# EAGLE design pickit3_adapter (EAGLE 6.2)
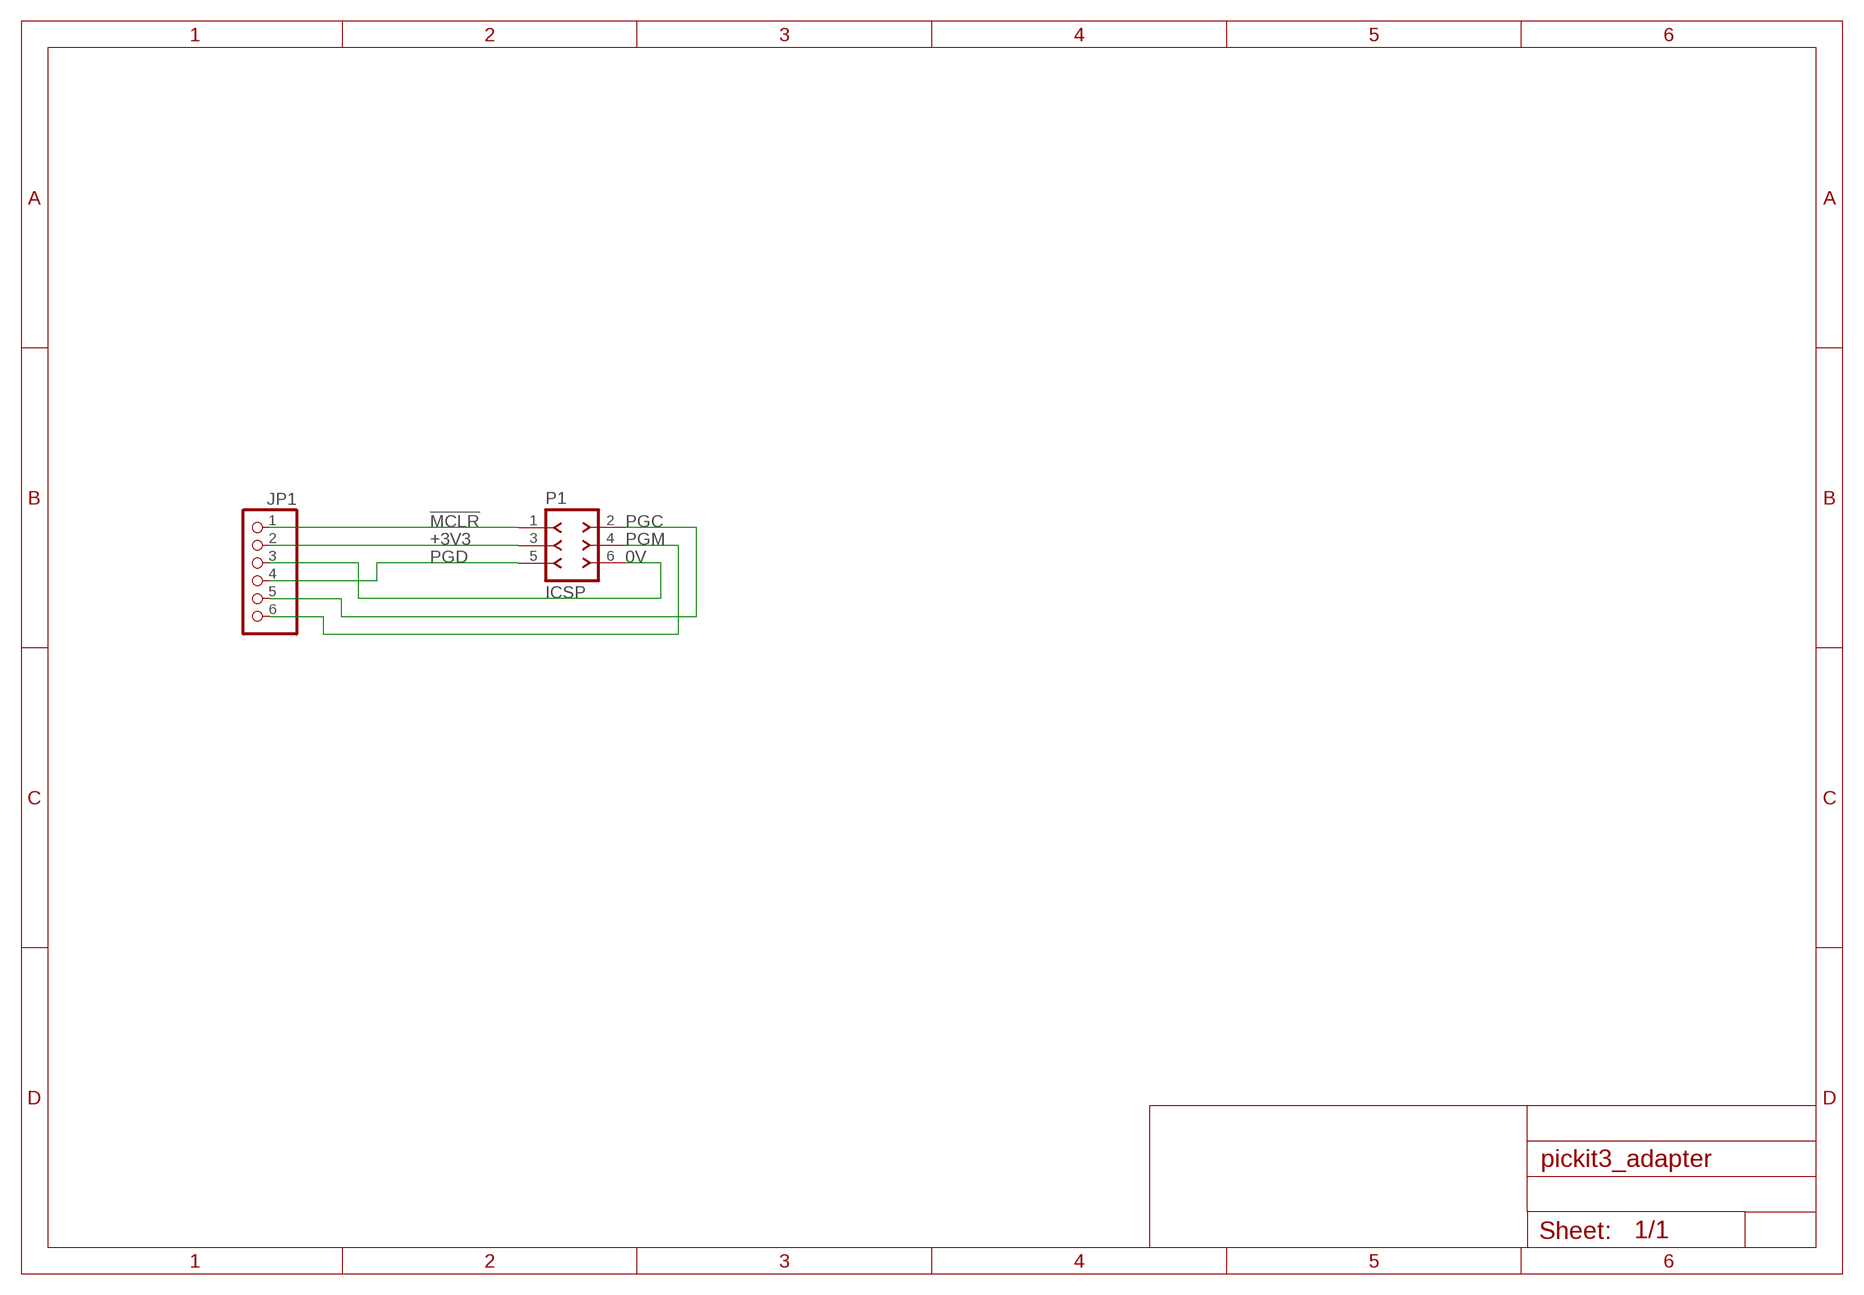
[diagram p0: schematic, sheet 1]

## Parts
JP1  PINHD-1X6/90  [1X06/90]
P1  ICSP  F-2X03-DIL-100  [DIL-100-2X03]

## Nets
0V: JP1.3 P1.6
!MCLR!: JP1.1 P1.1
+3V3: JP1.2 P1.3
PGC: JP1.5 P1.2
PGD: JP1.4 P1.5
PGM: JP1.6 P1.4

## Library data of the parts
JP1 = pinhead:PINHD-1X6: PIN HEADER
P1 = con-headers-jp:F-2X03-: FEMALE HEADER

## Board
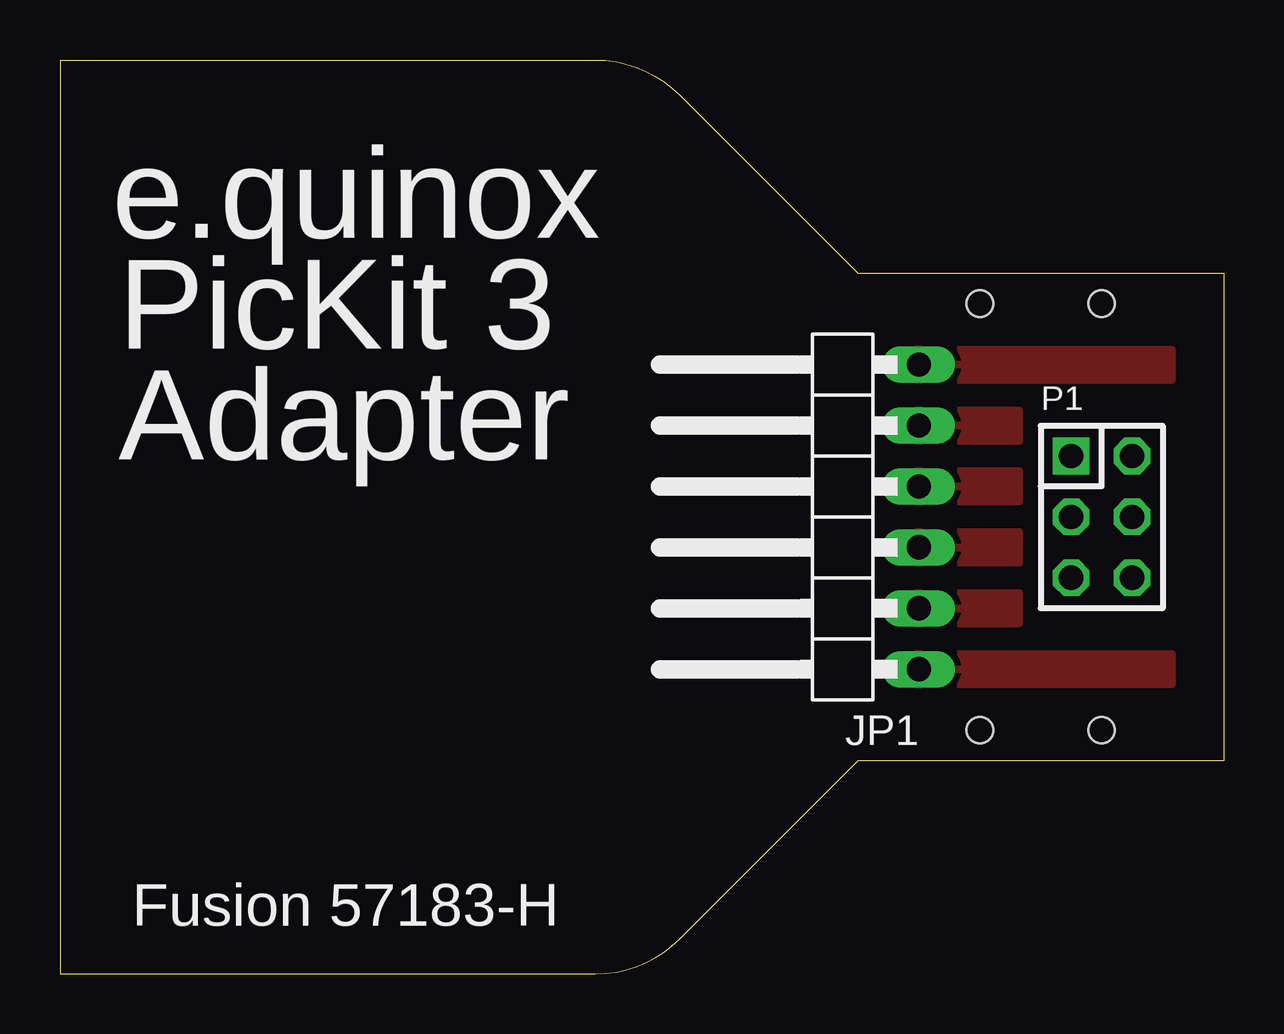
[diagram p1: board, top side]
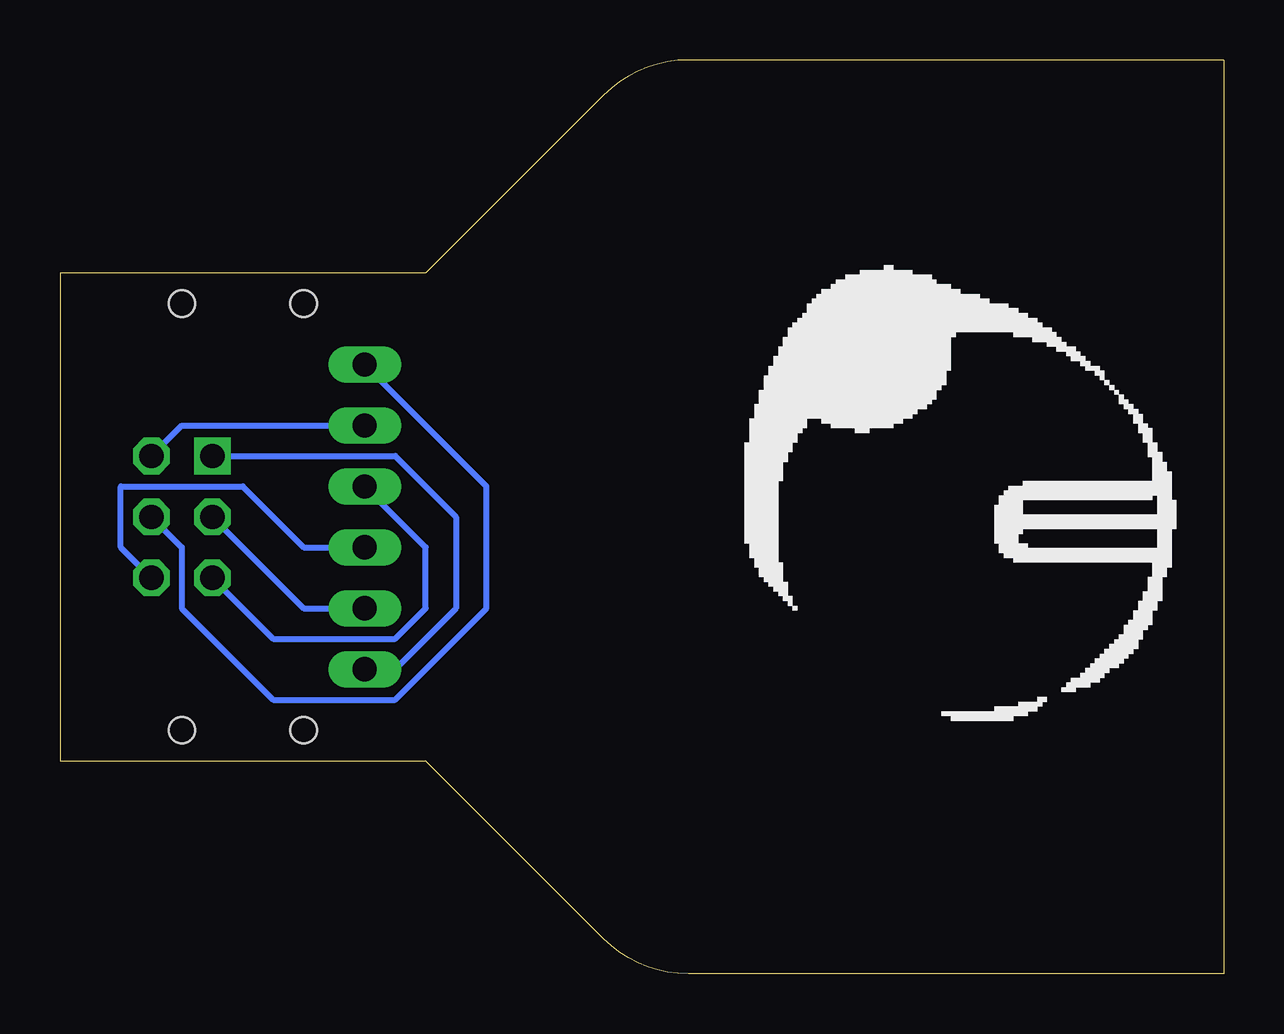
[diagram p2: board, bottom side, seen from below]

Size 48.5 x 38.1 mm. Coordinates in mm from the lower left corner, seen from the top.
Outline: 33.26,29.21 48.5,29.21 48.5,8.89 33.26,8.89 25.83,1.46 arc-45 22.3,0 0,0 0,38.1 22.3,38.1 arc-45 25.83,36.64 33.26,29.21
Copper layers (1*16): Top 0.035mm / dielectric 1.5mm / Bottom 0.035mm
Design rules: minimum track width 6mil, minimum drill 12mil, track to track 6mil, track to pad 6mil, pad to pad 6mil, via to via 6mil, smd to smd 0mil, copper to edge 10mil, drill to drill 10mil, minimum pad ring 10mil, minimum via ring 6mil, stop-mask expansion 2mil, vias tented up to drill 100mil, thermal gap 10mil
Holes 1.1 mm at 38.34,27.94 43.42,27.94 43.42,10.16 38.34,10.16

### Footprints (pad centres in the part's own frame; a part is rotated, then mirrored left to right if it is on the bottom)
1X06/90 = drill 1.016 long: 1 -6.35,-3.81; 2 -3.81,-3.81; 3 -1.27,-3.81; 4 1.27,-3.81; 5 3.81,-3.81; 6 6.35,-3.81
DIL-100-2X03 = drill 1.016 square: 1 -2.54,-1.27 | drill 1.016 octagon: 2 -2.54,1.27; 3 0,-1.27; 4 0,1.27; 5 2.54,-1.27; 6 2.54,1.27

### Placement (x,y rotation side)
JP1  31.99,19.05 90 top
P1  43.42,19.05 270 top
U$1  [EQNXLOGO]  9.86,19.05 0 bottom

### Tracks (layer width: path | path; a pad name or v marks a point on that pad's centre or on a via)
0V
  Bottom 0.254: JP1.3 38.34,17.78 40.88,20.32 45.96,20.32 45.96,17.78 P1.6
  pour Top: 39.99,17.14 34.4,17.14 34.4,18.41 39.99,18.41
!MCLR!
  Bottom 0.254: JP1.1 34.53,12.7 31.99,15.24 31.99,19.05 34.53,21.59 P1.1
  pour Top: 46.34,12.06 34.4,12.06 34.4,13.34 46.34,13.34
+3V3
  Bottom 0.254: JP1.2 38.34,15.24 P1.3
  pour Top: 39.99,14.61 34.4,14.61 34.4,15.88 39.99,15.88
PGC
  Bottom 0.254: JP1.5 43.42,22.86 P1.2
  pour Top: 39.99,22.23 34.4,22.23 34.4,23.5 39.99,23.5
PGD
  Bottom 0.254: JP1.4 33.26,17.78 33.26,15.24 34.53,13.97 39.61,13.97 P1.5
  pour Top: 39.99,19.68 34.4,19.68 34.4,20.95 39.99,20.95
PGM
  Bottom 0.254: JP1.6 30.72,20.32 30.72,15.24 34.53,11.43 39.61,11.43 43.42,15.24 43.42,17.78 P1.4
  pour Top: 46.34,24.77 34.4,24.77 34.4,26.04 46.34,26.04

### Text on the board
tPlace: e.quinox | PicKit 3 | Adapter | Fusion 57183-H